# EAGLE design untitled (EAGLE 6.4)
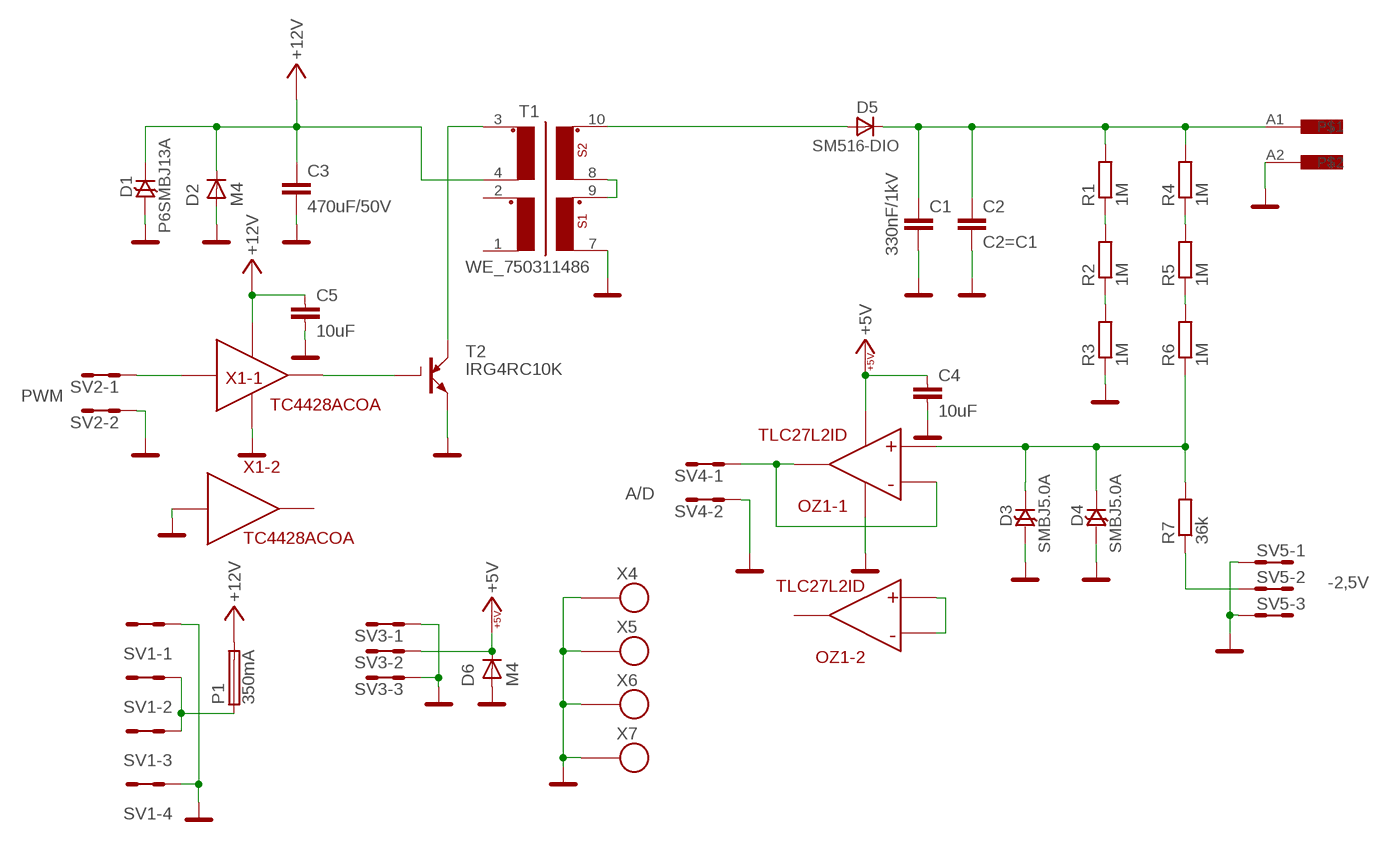
[diagram p0: schematic, sheet 1]

## Parts
C1  330nF/1kV  C-22,5MM  [C22,5MM]
C2  C2=C1  C-27,5MM  [C27,5MM]
C3  470uF/50V  C-EU050-025X075  [C050-025X075]
C4  10uF  C0805  [C0805]
C5  10uF  C0805  [C0805]
D1  P6SMBJ13A  D-TRANSIL  [SMB]
D2  M4  D-OB.SMA  [SMA]
D3  SMBJ5.0A  D-TRANSIL-SMA  [SMA]
D4  SMBJ5.0A  D-TRANSIL-SMA  [SMA]
D5  SM516-DIO  D-OB-MELF  [MELF]
D6  M4  D-OB.SMA  [SMA]
OZ1  TLC27L2ID  TLC27L2  [SOP8]
P1  350mA  POJISTKA_1812  [1812]
R1  1M  R1206  [1206]
R2  1M  R1206  [1206]
R3  1M  R1206  [1206]
R4  1M  R1206  [1206]
R5  1M  R1206  [1206]
R6  1M  R1206  [1206]
R7  36k  R0805  [0805]
SV1  MA04-2  [MA04-2]
SV2  MA02-2  [MA02-2]
SV3  MA03-2  [MA03-2]
SV4  MA02-2  [MA02-2]
SV5  MA03-2  [MA03-2]
T1  WE_750311486  TRAFO_WE_750311486  [TRAFO75311486]
T2  IRG4RC10K  IRG4RC10  [DPAK]
X1  TC4428ACOA  TC4428A  [SO8]
X2  SVORKOVNICE2X_PC  [SVORKOVNICE_10,16MM]
X4  SROUB3M  [SROUB3M]
X5  SROUB3M  [SROUB3M]
X6  SROUB3M  [SROUB3M]
X7  SROUB3M  [SROUB3M]

## Nets
+5V: C4.1 D6.K(C) OZ1.4(-1:GND) SV3.3 SV3.4
+12V: C3.1 C5.1 D1.K D2.K(C) P1.2 T1.4 X1.6(-1:VDD)
GND: C1.P$3 C2.P$2 C3.2 C4.2 C5.2 D1.A D2.A D3.A D4.A D6.A OZ1.8(-1:VDD) R3.1 SV1.1 SV1.2 SV1.7 SV1.8 SV2.3 SV2.4 SV3.1 SV3.2 SV3.5 SV3.6 SV4.3 SV4.4 SV5.1 SV5.2 SV5.5 SV5.6 T1.7 T2.S(E) X1.3(-1:GND) X1.4(-2:-) X2.A2 X4.P$1 X5.P$1 X6.P$1 X7.P$1
N$1: T1.3 T2.D(C)
N$2: T2.G X1.7(-1:VOUT)
N$4: SV2.1 SV2.2 X1.2(-1:-)
N$5: T1.8 T1.9
N$6: D5.A T1.10
N$7: C1.P$2 C2.P$1 D5.C(K) R1.2 R4.2 X2.A1
N$8: R1.1 R2.2
N$9: R2.1 R3.2
N$10: R4.1 R5.2
N$11: R5.1 R6.2
N$12: D3.K D4.K OZ1.3(-1:+) R6.1 R7.2
N$13: OZ1.1(-1:VOUT) OZ1.2(-1:-) SV4.1 SV4.2
N$14: P1.1 SV1.3 SV1.4 SV1.5 SV1.6
N$15: OZ1.5(-2:+) OZ1.6(-2:-)
N$16: R7.1 SV5.3 SV5.4
Unconnected: OZ1.7(-2:VOUT) T1.1 T1.2 X1.5(-2:VOUT)

## Notes on the sheet
- PWM
- A/D
- -2,5V

## Library data of the parts
C1 = moje:C-22,5MM
C2 = moje:C-27,5MM
C3 = rcl:C-EU: CAPACITOR, European symbol
C4 C5 = moje_C:C0805
D1 = moje_diody:D-TRANSIL: Trnasil SMB
D2 D6 = moje:D-OB.SMA: SMA
D3 D4 = moje_diody:D-TRANSIL-SMA
D5 = moje_diody:D-OB-MELF
OZ1 = moje_OZ:TLC27L2
P1 = moje:POJISTKA_1812: Pojistka s pouzdrem 1812
R1-R6 = moje_R:R1206
R7 = moje_R:R0805
SV1 = moje_hrebinky:MA04-2: PIN HEADER; OC_FARNELL: unknown; OC_NEWARK: unknown
SV2 SV4 = moje_hrebinky:MA02-2
SV3 SV5 = moje_hrebinky:MA03-2: PIN HEADER; OC_FARNELL: unknown; OC_NEWARK: unknown
T1 = moje:TRAFO_WE_750311486: Trafo WE 750311486
T2 = moje_T:IRG4RC10: IGBT N - DPAK
X1 = moje_io:TC4428A
X2 = moje:SVORKOVNICE2X_PC
X4-X7 = moje:SROUB3M

## Board
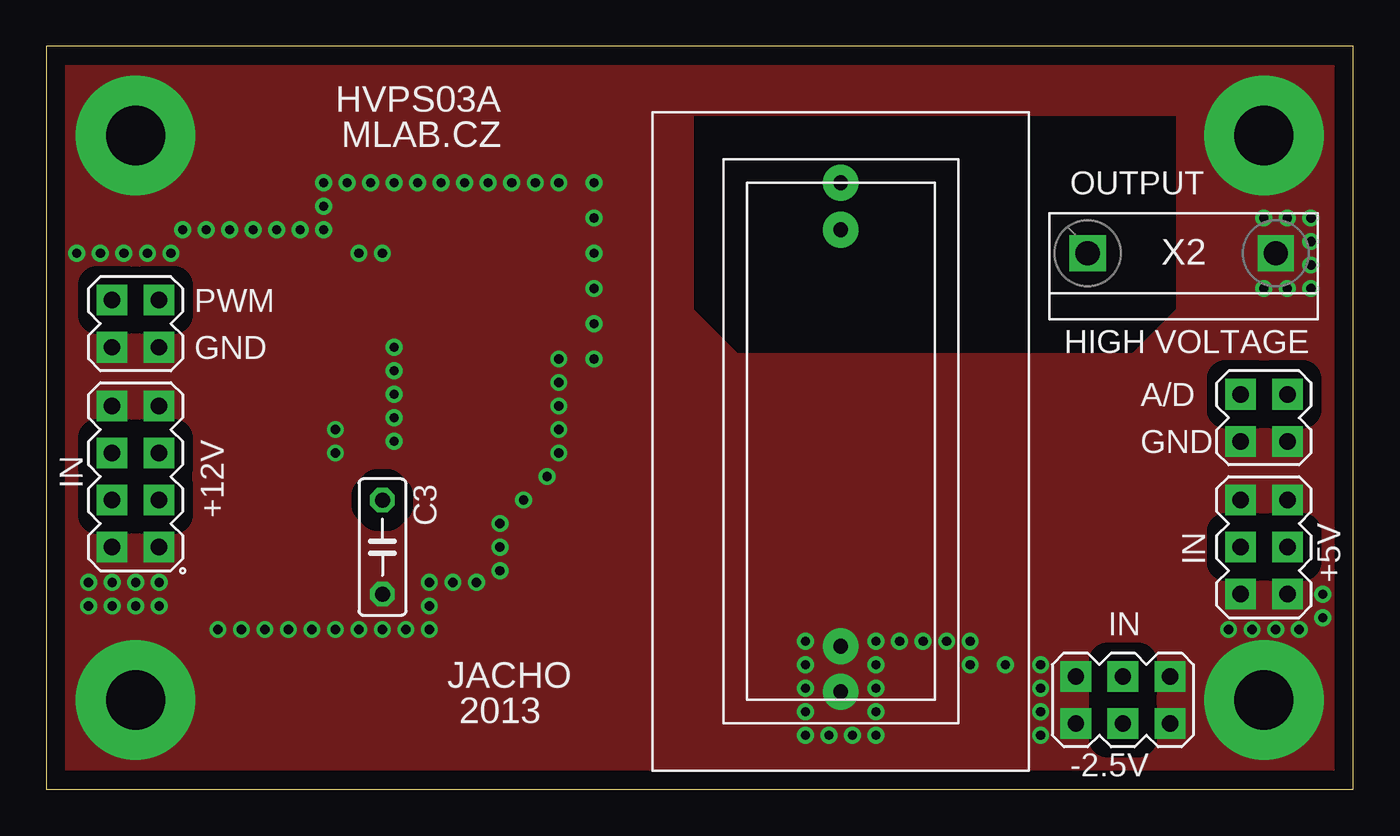
[diagram p1: board, top side]
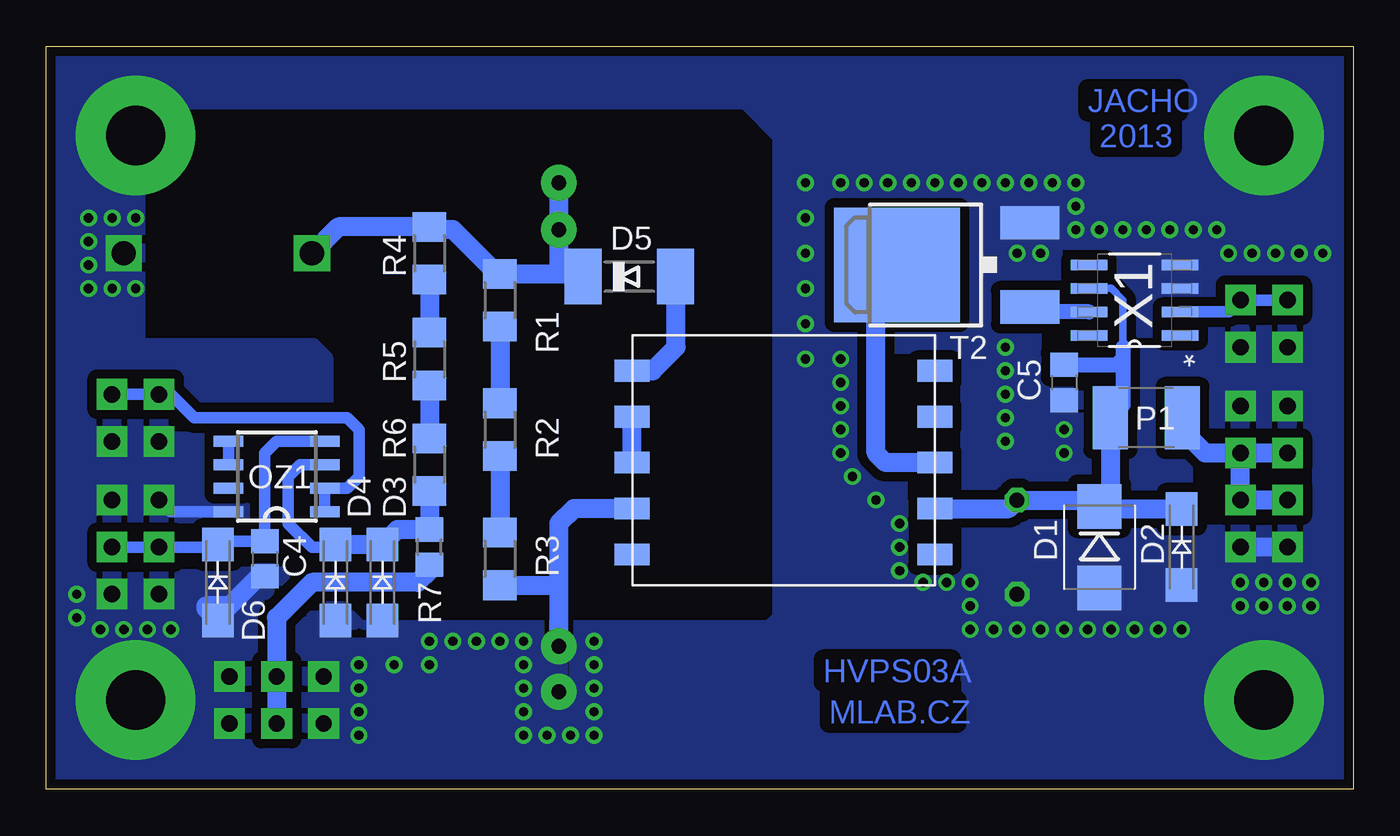
[diagram p2: board, bottom side, seen from below]

Size 70.61 x 40.13 mm. Coordinates in mm from the lower left corner, seen from the top.
Outline: 0,0 70.61,0 70.61,40.13 0,40.13 0,0
Copper layers (1*16): Top 0.035mm / dielectric 1.5mm / Bottom 0.035mm
Design rules "jacho35 *": minimum track width 8mil, minimum drill 16mil, track to track 20mil, track to pad 20mil, pad to pad 12mil, via to via 12mil, smd to smd 8mil, copper to edge 20mil, drill to drill 8mil, minimum pad ring 10mil, minimum via ring 8mil, stop-mask expansion 4mil, vias tented up to drill 25mil, thermal gap 0mil

### Footprints (pad centres in the part's own frame; a part is rotated, then mirrored left to right if it is on the bottom)
C22,5MM = drill 0.8 pad 1.93: P$2 0,0; P$3 22.5,0
C27,5MM = drill 0.8 pad 1.93: P$1 0,0; P$2 27.5,0
C050-025X075 = drill 0.813 octagon: 1 -2.54,0; 2 2.54,0
C0805 = smd 1.3 x 1.5: 1 -0.95,0; 2 0.95,0
SMB = smd 2.4 x 2.4: A 2.2,0; K -2.2,0
SMA = smd 1.8 x 1.7: A -2.05,0; K 2.05,0
MELF = smd 2 x 3: A 2.5,0; C -2.5,0
SOP8 = smd 0.6 x 1.6: 1 -1.905,-2.6; 2 -0.635,-2.6; 3 0.635,-2.6; 4 1.905,-2.6; 5 1.905,2.6; 6 0.635,2.6; 7 -0.635,2.6; 8 -1.905,2.6
1812 = smd 1.9 x 3.4: 1 -1.95,0; 2 1.95,0
1206 = smd 1.6 x 1.803: 1 -1.422,0; 2 1.422,0
0805 = smd 1.3 x 1.5: 1 -0.95,0; 2 0.95,0
MA04-2 = drill 0.889 pad 1.651 square: 1 -3.81,-1.27; 2 -3.81,1.27; 3 -1.27,-1.27; 4 -1.27,1.27; 5 1.27,-1.27; 6 1.27,1.27; 7 3.81,-1.27; 8 3.81,1.27
MA02-2 = drill 0.889 pad 1.651 square: 1 -1.27,-1.27; 2 -1.27,1.27; 3 1.27,-1.27; 4 1.27,1.27
MA03-2 = drill 0.889 pad 1.651 square: 1 -2.54,-1.27; 2 -2.54,1.27; 3 0,-1.27; 4 0,1.27; 5 2.54,-1.27; 6 2.54,1.27
TRAFO75311486 = smd 1.88 x 1.17: 1 0,0; 2 0,2.48; 3 0,4.96; 4 0,7.44; 5 0,9.92; 6 16.36,9.92; 7 16.36,7.44; 8 16.36,4.96; 9 16.36,2.48; 10 16.36,0
DPAK = smd 6.2 x 6.8: D 0,1.41 | smd 1.8 x 3.2: G -2.28,-5.77; S 2.28,-5.77
SO8 = smd 1.981 x 0.559: 1 -2.464,1.905; 2 -2.464,0.635; 3 -2.464,-0.635; 4 -2.464,-1.905; 5 2.464,-1.905; 6 2.464,-0.635; 7 2.464,0.635; 8 2.464,1.905
SVORKOVNICE_10,16MM = drill 1.3 pad 1.905 square: A1 -5.08,0; A2 5.08,0
SROUB3M = drill 3.2 pad 6.452: P$1 0,0

### Placement (x,y rotation side)
C1  42.93,30.23 270 top
C2  42.93,32.77 270 top
C3  18.16,13.08 270 top
C4  58.8,12.45 270 bottom
C5  15.62,21.97 270 bottom
D1  13.72,13.08 270 bottom
D2  9.27,13.08 90 bottom
D3  52.45,11.18 90 bottom
D4  54.99,11.18 90 bottom
D5  39.12,27.69 0 bottom
D6  61.34,11.18 90 bottom
OZ1  58.17,16.89 90 bottom
P1  11.18,20.07 180 bottom
R1  46.1,26.42 90 bottom
R2  46.1,19.43 90 bottom
R3  46.1,12.45 90 bottom
R4  49.91,28.96 90 bottom
R5  49.91,23.24 90 bottom
R6  49.91,17.53 90 bottom
R7  49.91,13.08 90 bottom
SV1  4.83,16.89 90 top
SV2  4.83,25.15 270 top
SV3  65.79,13.08 90 top
SV4  65.79,20.07 270 top
SV5  58.17,4.83 0 top
T1  22.61,22.61 180 bottom
T2  23.24,28.32 90 bottom
X1  11.81,26.42 180 bottom
X2  61.34,28.96 0 top
X4  4.83,4.83 0 top
X5  4.83,35.31 0 top
X6  65.79,4.83 0 top
X7  65.79,35.31 0 top

### Tracks (layer width: path | path; a pad name or v marks a point on that pad's centre or on a via)
+5V
  Bottom 0.61: OZ1.4 58.17,18.8 58.8,18.16 C4.1 61.17,13.4 D6.K 61.49,13.08 SV3.4 SV3.3
+12V
  Bottom 0.406: X1.6 13.08,27.05 12.45,26.42 12.45,23.88
  Bottom 0.813: 12.45,23.88 12.45,23.24 | 12.45,23.24 12.45,20.75 P1.2 | C5.1 12.77,22.92 12.45,23.24
  Bottom 1.016: D2.K 13.57,15.13 D1.K | P1.2 13.13,15.87 D1.K | D1.K 14.06,15.62 C3.1 18.62,15.17 T1.4
GND  (via drill 0.5)
  Bottom 0.61: OZ1.8 63.88,14.99 SV3.6
  Bottom 1.016: SV1.2 SV1.1 | T1.7 42.11,15.17 42.93,14.35 42.93,11.18 | 42.93,11.18 C1.P$3 | R3.1 43.08,11.02 42.93,11.18 | C4.2 59.12,11.5 60.71,9.91 61.98,9.91 61.98,9.76 D6.A
  other vias: 17.53,32.77 18.8,32.77 20.07,32.77 21.34,32.77 22.61,32.77 23.88,32.77 25.15,32.77 26.42,32.77 27.69,32.77 29.59,32.77 29.59,30.86 29.59,28.96 29.59,27.05 29.59,25.15 29.59,23.24 27.69,23.24 16.26,32.77 14.99,32.77 14.99,31.5 14.99,30.23 16.89,28.96 18.16,28.96 2.29,11.18 3.56,11.18 4.83,11.18 6.1,11.18 2.29,9.91 3.56,9.91 4.83,9.91 6.1,9.91 9.27,8.64 10.54,8.64 11.81,8.64 13.08,8.64 14.35,8.64 15.62,8.64 16.89,8.64 18.16,8.64 19.43,8.64 20.7,8.64 20.7,9.91 20.7,11.18 41.02,8 41.02,6.73 41.02,5.46 41.02,4.19 41.02,2.92 42.29,2.92 43.56,2.92 44.83,2.92 44.83,4.19 44.83,5.46 44.83,6.73 44.83,8 68.33,30.86 68.33,29.59 68.33,28.32 68.33,27.05 67.06,27.05 65.79,27.05 67.06,30.86 65.79,30.86 68.96,10.54 68.96,9.27 67.69,8.64 66.42,8.64 65.15,8.64 63.88,8.64 53.72,6.73 53.72,5.46 53.72,4.19 53.72,2.92 46.1,8 47.37,8 48.64,8 49.91,8 49.91,6.73 51.82,6.73 18.8,23.88 18.8,22.61 18.8,21.34 18.8,20.07 18.8,18.8 15.62,19.43 15.62,18.16 27.69,21.97 27.69,20.7 27.69,19.43 27.69,18.16 27.05,16.89 25.78,15.62 24.51,14.35 24.51,13.08 24.51,11.81 21.97,11.18 23.24,11.18 1.65,28.96 2.92,28.96 4.19,28.96 5.46,28.96 6.73,28.96 7.37,30.23 13.72,30.23 12.45,30.23 11.18,30.23 9.91,30.23 8.64,30.23
  pour Bottom: -0.25,40.39 -0.25,0.38 49.91,0.38 49.91,8.64 31.5,8.64 30.86,9.27 30.86,35.31 32.77,37.21 70.23,37.21 70.23,39.75 0.38,39.75
  pour Bottom: 49.28,0.38 70.87,0.38 70.87,40.39 61.34,40.39 61.34,39.12 65.79,34.67 65.79,23.88 56.26,23.88 55.63,23.24 55.63,10.54 53.72,8.64 47.37,8.64 47.37,2.29
  pour Top (isolate 1.016): -0.25,40.39 -0.25,0.38 70.87,0.38 70.87,40.39 63.25,40.39 61.34,38.48 61.34,25.78 58.8,23.24 37.21,23.24 34.67,25.78 34.67,39.12 34.04,39.75 0.38,39.75
  pour Top (isolate 1.016): 35.31,39.75 34.67,39.75 34.67,36.58 65.79,36.58 65.79,39.75
N$1
  Bottom 1.016: T1.3 25.27,17.65 25.78,18.16 25.78,27.19 T2.D
N$2
  Bottom 0.813: X1.7 17.21,25.78 T2.G
N$4
  Bottom 0.61: X1.2 6.73,25.78 SV2.2 SV2.1
N$5
  Bottom 1.016: T1.8 T1.9
N$6
  Bottom 1.016: T1.10 37.85,22.61 36.58,23.88 36.58,27.65 D5.A
N$7
  Bottom 1.016: C2.P$1 C1.P$2 42.93,27.84 | 41.66,27.73 D5.C 41.77,27.84 42.93,27.84 | 42.93,27.84 R1.2 46.25,27.84 48.64,30.23 49.76,30.23 R4.2 54.84,30.38 X2.A1
N$8
  Bottom 1.016: R1.1 R2.2
N$9
  Bottom 1.016: R2.1 R3.2
N$10
  Bottom 1.016: R4.1 R5.2
N$11
  Bottom 1.016: R5.1 R6.2
N$12
  Bottom 0.61: OZ1.3 56.9,17.53 57.53,16.89 57.53,14.99 57.53,14.35 56.26,13.08 55.14,13.08 D4.K 55.48,13.72
  Bottom 1.016: R6.1 R7.2 51.65,14.03 D3.K 53.09,13.23 53.72,13.23 D4.K
N$13
  Bottom 0.61: OZ1.1 OZ1.2 54.36,16.26 53.72,16.89 53.72,19.43 54.36,20.07 62.61,20.07 63.88,21.34 SV4.1 SV4.2
N$14
  Bottom 1.016: SV1.4 SV1.3 SV1.5 | SV1.6 SV1.5 | SV1.5 8,18.16 9.27,19.43 9.27,20.02 P1.1
N$15
  Bottom 0.61: OZ1.6 OZ1.5
N$16
  Bottom 1.016: R7.1 49.91,11.81 50.55,11.18 56.26,11.18 58.17,9.27 SV5.4 SV5.3

### Text on the board
Bottom: JACHO | 2013 | HVPS03A | MLAB.CZ
tPlace: HVPS03A | MLAB.CZ | OUTPUT | PWM | HIGH VOLTAGE | GND | A/D | GND | IN | +12V | IN | +5V | IN | JACHO | 2013 | -2.5V